# EAGLE schematic sp0256_dcf77 (EAGLE 7.7.0)
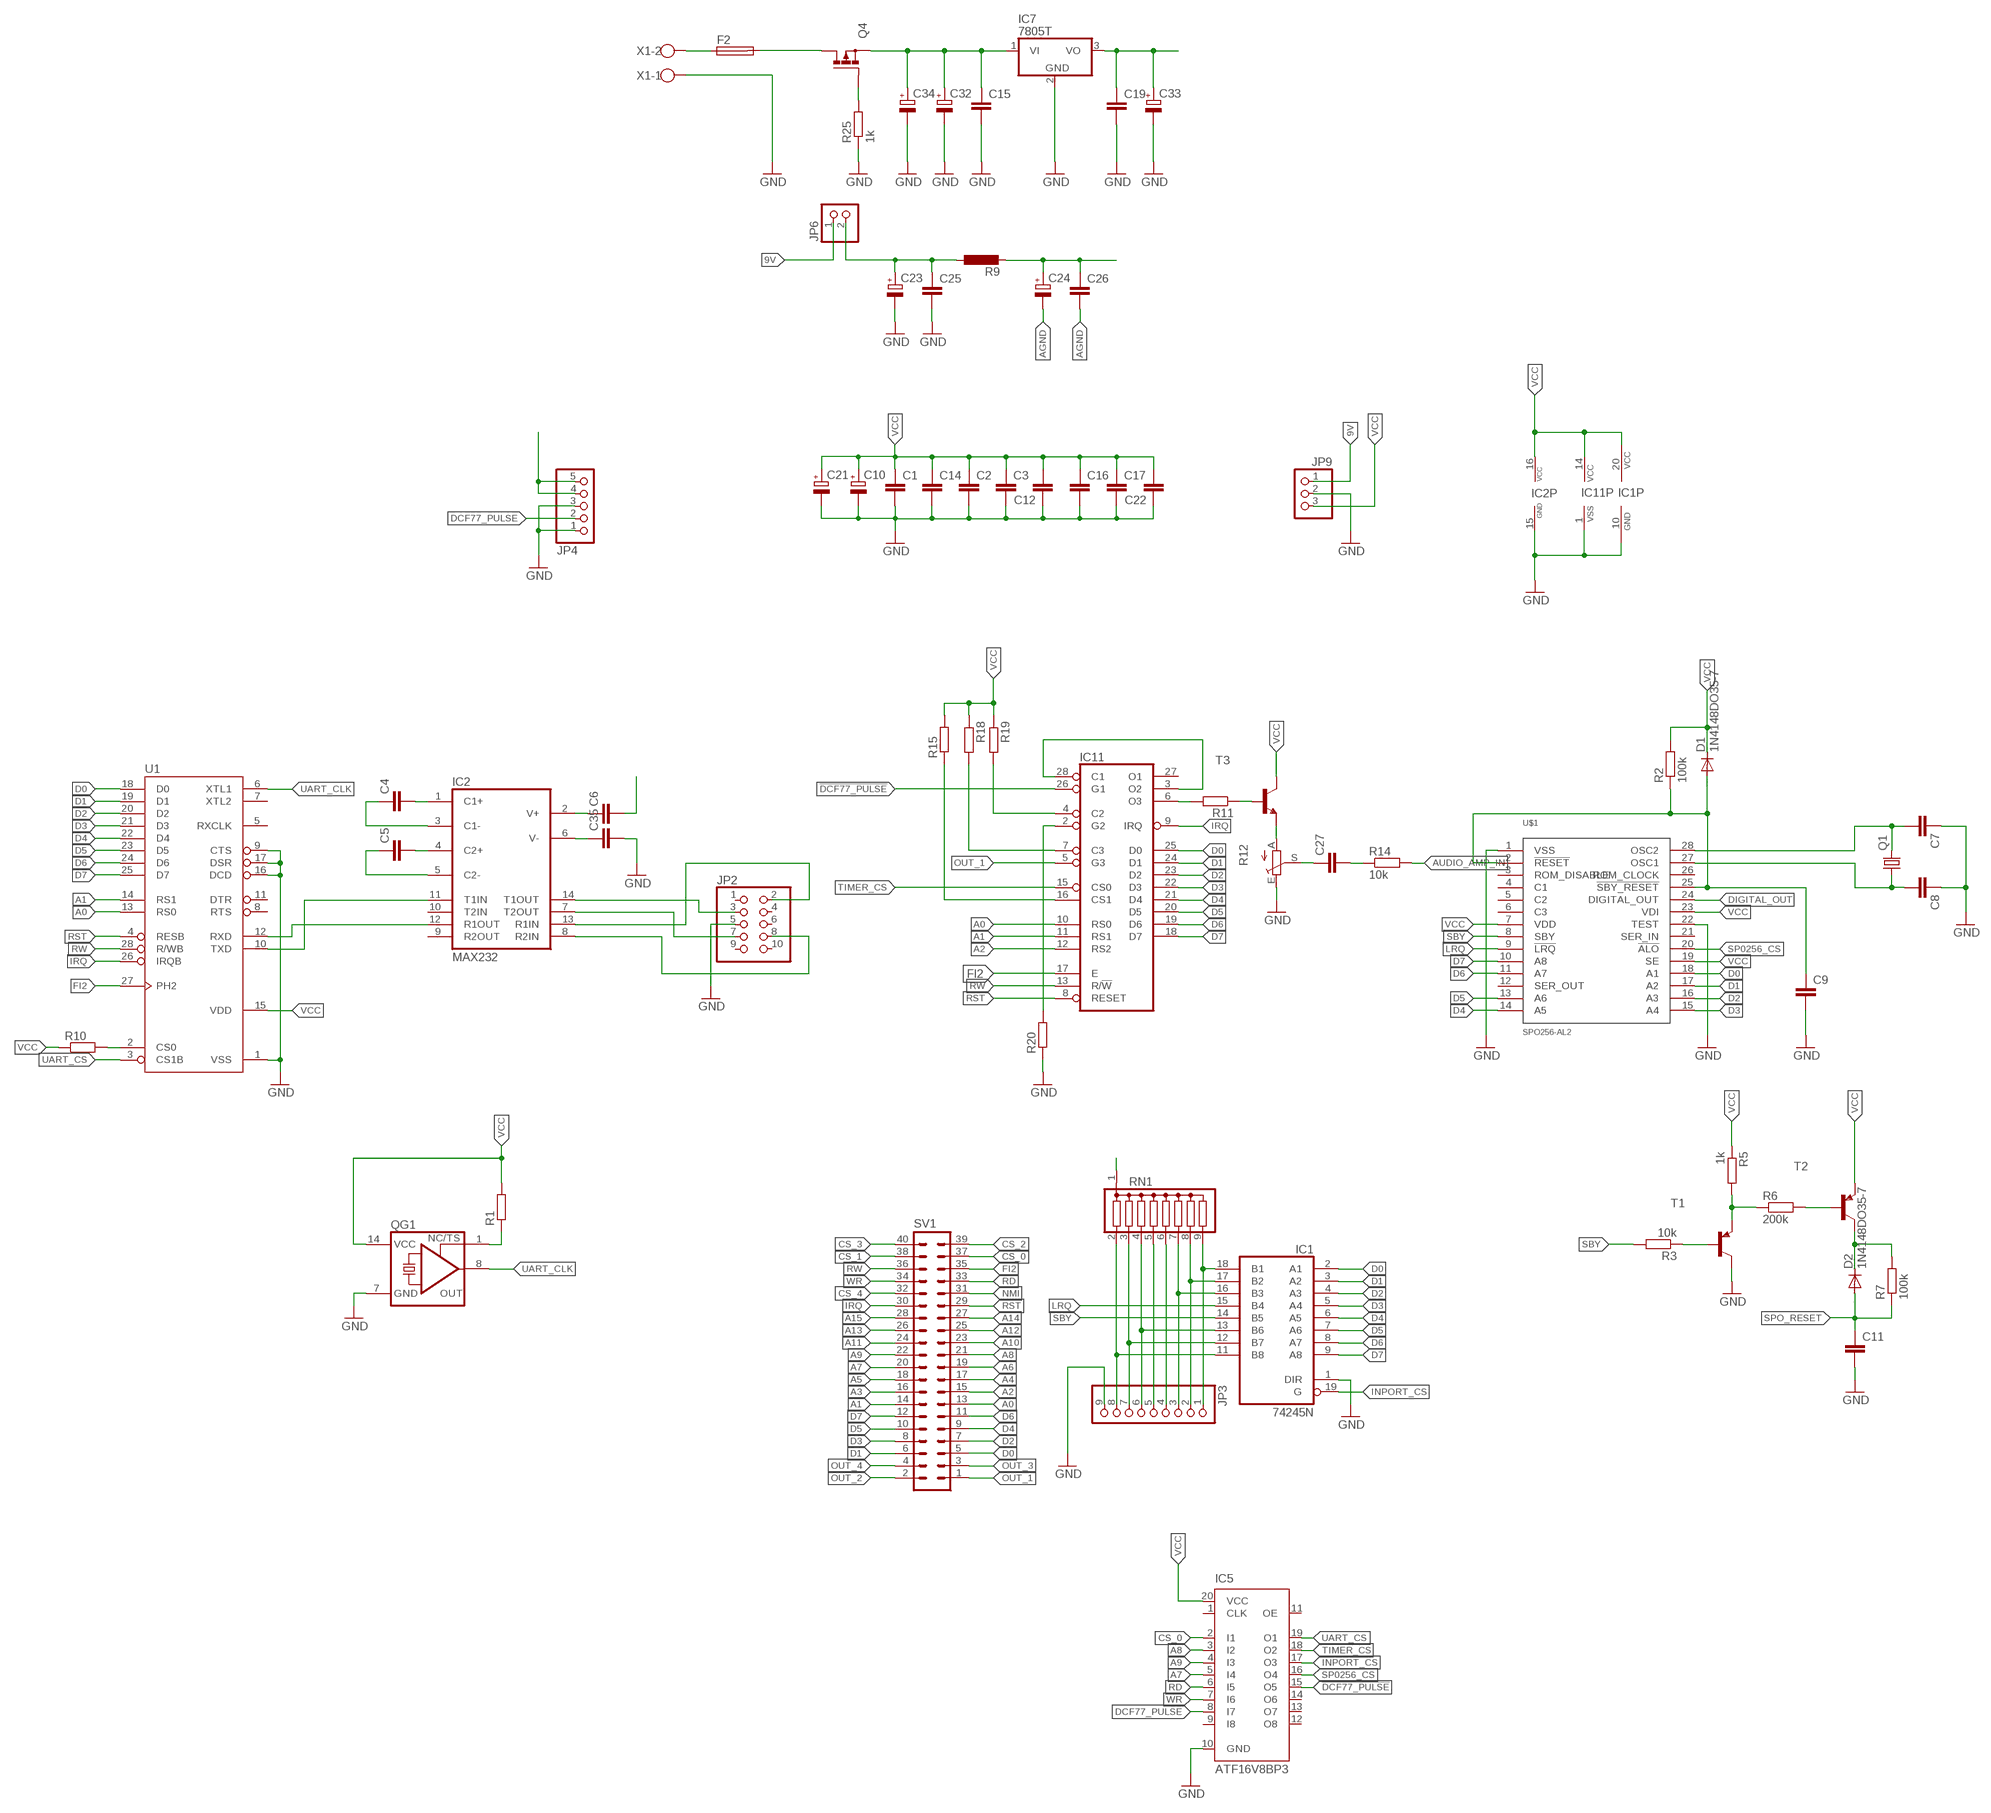
[diagram p0: schematic, sheet 1, part 1 of 2]
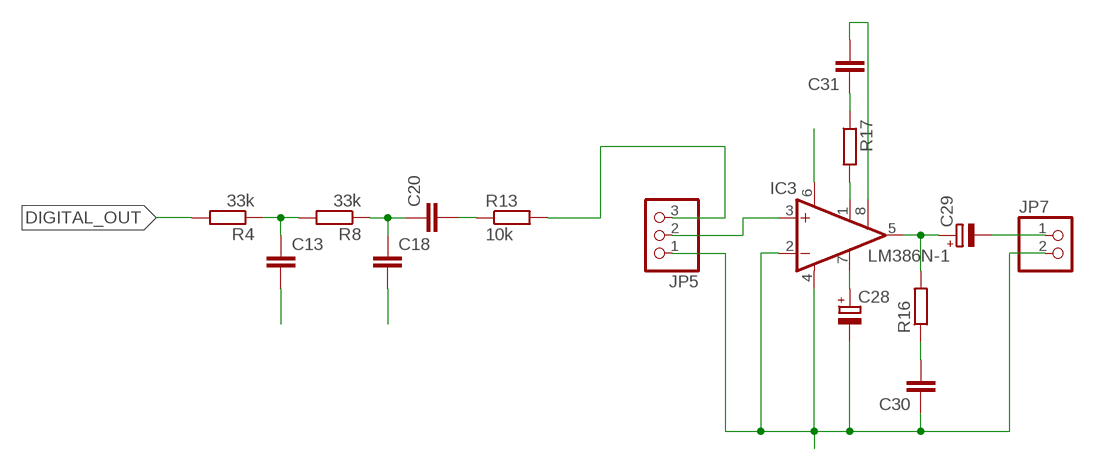
[diagram p1: schematic, sheet 1, part 2 of 2]

## Parts
C1  C-EUC1206  [C1206]
C2  C-EUC1206  [C1206]
C3  C-EUC1206  [C1206]
C4  C-EUC0603  [C0603]
C5  C-EUC0603  [C0603]
C6  C-EUC0603  [C0603]
C7  C-EUC0603  [C0603]
C8  C-EUC0603  [C0603]
C9  C-EUC0603  [C0603]
C10  CPOL-EUE5-10.5  [E5-10,5]
C11  C-EUC0603  [C0603]
C12  C-EUC0603  [C0603]
C13  C-EUC0603  [C0603]
C14  C-EUC1206  [C1206]
C15  C-EUC1206  [C1206]
C16  C-EUC1206  [C1206]
C17  C-EUC1206  [C1206]
C18  C-EUC0603  [C0603]
C19  C-EUC1206  [C1206]
C20  C-EUC0603  [C0603]
C21  CPOL-EUSMCB  [SMC_B]
C22  C-EUC0603  [C0603]
C23  CPOL-EUE5-10.5  [E5-10,5]
C24  CPOL-EUE5-10.5  [E5-10,5]
C25  C-EUC1206  [C1206]
C26  C-EUC1206  [C1206]
C27  C-EUC0603  [C0603]
C28  CPOL-EUSMCB  [SMC_B]
C29  CPOL-EUE5-10.5  [E5-10,5]
C30  C-EUC0603  [C0603]
C31  C-EUC0603  [C0603]
C32  CPOL-EUE5-10.5  [E5-10,5]
C33  CPOL-EUE5-10.5  [E5-10,5]
C34  CPOL-EUE5-10.5  [E5-10,5]
C35  C-EUC0603  [C0603]
D1  1N4148DO35-7  [DO35-7]
D2  1N4148DO35-7  [DO35-7]
F2  SH22,5  [SH22,5]
IC1  74245N  74LS245N  [DIL20]
IC2  MAX232  [DIL16]
IC3  LM386N-1  [DIL08]
IC5  ATF16V8BP3  [DIL20]
IC7  7805T  [TO220H]
IC11  6840  [DIL28]
JP2  PINHD-2X5  [2X05]
JP3  PINHD-1X9  [1X09]
JP4  PINHD-1X5  [1X05]
JP5  PINHD-1X3  [1X03]
JP6  PINHD-1X2  [1X02]
JP7  PINHD-1X2  [1X02]
JP9  PINHD-1X3/90  [1X03/90]
Q1  CRYSTALHC49U-V  [HC49U-V]
Q4  P-MOSFET-SO8  [SO-08]
QG1  XO-14  [DIL14S]
R1  R-EU_R1206  [R1206]
R2  100k  R-EU_0204/7  [0204/7]
R3  10k  R-EU_0204/7  [0204/7]
R4  33k  R-EU_0204/7  [0204/7]
R5  1k  R-EU_0204/5  [0204/5]
R6  200k  R-EU_R0603  [R0603]
R7  100k  R-EU_0204/7  [0204/7]
R8  33k  R-EU_0204/7  [0204/7]
R9  L-EU0204/7  [0204/7]
R10  R-EU_R0603  [R0603]
R11  R-EU_0204/7  [0204/7]
R12  TRIM_EU-CA6V  [CA6V]
R13  10k  R-EU_R0603  [R0603]
R14  10k  R-EU_R0603  [R0603]
R15  R-EU_R0603  [R0603]
R16  R-EU_R0603  [R0603]
R17  R-EU_0204/7  [0204/7]
R18  R-EU_R0603  [R0603]
R19  R-EU_R0603  [R0603]
R20  R-EU_R0603  [R0603]
R25  1k  R-EU_R0603  [R0603]
RN1  G08R  [SIL9]
SV1  ML40L  [ML40L]
T1  MPS2907A-PNP-TO92-CBE  [TO92-CBE]
T2  MPS2907A-PNP-TO92-CBE  [TO92-CBE]
T3  BC550-NPN-TO92-CBE  [TO92-CBE]
U1  G65SC51P  [DIP-28]
U$1  SPO256-AL2  [DIL28]
X1  W237-102  [W237-102]

## Nets
9V: C15.1 C32.+ C34.+ IC7.1(VI) JP6.1 JP9.1 Q4.1(S) Q4.2(S) Q4.3(S)
9V_SW: C23.+ C25.1 JP6.2 R9.1
!DCF77_PULSE: IC5.15(O5) IC11.26(G1)
A0: IC11.10(RS0) SV1.13 U1.13(RS0)
A1: IC11.11(RS1) SV1.14 U1.14(RS1)
A2: IC11.12(RS2) SV1.15
A3: SV1.16
A4: SV1.17
A5: SV1.18
A6: SV1.19
A7: IC5.5(I4) SV1.20
A8: IC5.3(I2) SV1.21
A9: IC5.4(I3) SV1.22
A10: SV1.23
A11: SV1.24
A12: SV1.25
A13: SV1.26
A14: SV1.27
A15: SV1.28
AGND: C13.2 C18.2 C24.- C26.2 C28.- C30.1 IC3.2(-IN) IC3.4(GND) JP5.1 JP7.2
AUDIO_AMP_IN: JP5.3 R13.2 R14.2
AVCC: C24.+ C26.1 IC3.6(VS) R9.2
CS_0: IC5.2(I1) SV1.37
CS_1: SV1.38
CS_2: SV1.39
CS_3: SV1.40
CS_4: SV1.32
D0: IC1.2(A1) IC11.25(D0) SV1.5 U1.18(D0) U$1.18(A1)
D1: IC1.3(A2) IC11.24(D1) SV1.6 U1.19(D1) U$1.17(A2)
D2: IC1.4(A3) IC11.23(D2) SV1.7 U1.20(D2) U$1.16(A3)
D3: IC1.5(A4) IC11.22(D3) SV1.8 U1.21(D3) U$1.15(A4)
D4: IC1.6(A5) IC11.21(D4) SV1.9 U1.22(D4) U$1.14(A5)
D5: IC1.7(A6) IC11.20(D5) SV1.10 U1.23(D5) U$1.13(A6)
D6: IC1.8(A7) IC11.19(D6) SV1.11 U1.24(D6) U$1.11(A7)
D7: IC1.9(A8) IC11.18(D7) SV1.12 U1.25(D7) U$1.10(A8)
DCF77_PULSE: IC5.8(I7) JP4.2
DIGITAL_OUT: R4.2 U$1.24(DIGITAL_OUT)
FI2: IC11.17(E) SV1.35 U1.27(PH2)
GATE2: IC11.2(G2) R20.2
GND: C1.2 C2.2 C3.2 C7.1 C8.1 C9.2 C10.- C11.2 C12.1 C14.2 C15.2 C16.2 C17.2 C19.2 C21.- C22.1 C23.- C25.2 C32.- C33.- C34.- C35.2 IC1.1(DIR) IC1.10(GND) IC2.15(GND) IC5.10(GND) IC7.2(GND) IC11.1(VSS) JP2.5 JP3.9 JP4.1 JP4.3 JP9.2 QG1.7(GND) R12.E R20.1 R25.1 T1.C U1.1(VSS) U1.9(CTS) U1.16(DCD) U1.17(DSR) U$1.1(VSS) U$1.22(TEST) X1.1
INPORT_CS: IC1.19(G) IC5.17(O3)
IRQ: IC11.9(IRQ) SV1.30 U1.26(IRQB)
LRQ: IC1.15(B4) U$1.9(!LRQ)
N$1: Q4.4(G) R25.2
N$3: IC11.3(O2) IC11.28(C1)
N$4: C35.1 IC2.6(V-)
N$5: QG1.1(TS) R1.1
N$6: C7.2 Q1.2 U$1.28(OSC2)
N$7: C8.2 Q1.1 U$1.27(OSC1)
N$8: R3.1 T1.B
N$9: C4.2 IC2.1(C1+)
N$10: C5.2 IC2.4(C2+)
N$11: C5.1 IC2.5(C2-)
N$12: C4.1 IC2.3(C1-)
N$13: C6.1 IC2.2(V+)
N$15: IC1.18(B1) JP3.1 RN1.9
N$16: IC1.17(B2) JP3.2 RN1.8
N$17: IC1.16(B3) JP3.3 RN1.7
N$18: C13.1 R4.1 R8.2
N$19: JP3.5 RN1.5
N$20: IC1.13(B6) JP3.6 RN1.4
N$21: IC1.12(B7) JP3.7 RN1.3
N$22: IC1.11(B8) JP3.8 RN1.2
N$26: JP3.4 RN1.6
N$27: R10.2 U1.2(CS0)
N$28: R5.2 R6.1 T1.E
N$29: R6.2 T2.B
N$30: D2.C R7.2 T2.C
N$31: IC11.16(CS1) R15.1
N$32: C18.1 C20.1 R8.1
N$33: C28.+ IC3.7(BYPASS)
N$34: IC11.7(C3) R18.2
N$35: IC11.6(O3) R11.2
N$36: R11.1 T3.B
N$38: R12.A T3.E
N$39: C27.1 R12.S
N$40: C27.2 R14.1
N$41: C20.2 R13.1
N$42: IC3.3(+IN) JP5.2
N$43: C29.+ IC3.5(OUT) R16.2
N$45: C30.2 R16.1
N$46: IC3.1(GAIN) R17.2
N$47: C31.1 R17.1
N$48: C31.2 IC3.8(GAIN)
N$49: C29.- JP7.1
N$50: IC11.4(C2) R19.2
N$52: F2.2 Q4.5(D) Q4.6(D) Q4.7(D) Q4.8(D)
N$53: F2.1 X1.2
NMI: SV1.31
OUT_1: IC11.5(G3) SV1.1
OUT_2: SV1.2
OUT_3: SV1.3
OUT_4: SV1.4
RD: IC5.6(I5) SV1.33
RS_CTS: IC2.8(R2IN) JP2.8
RS_RTS: IC2.7(T2OUT) JP2.7
RS_RXD: IC2.13(R1IN) JP2.2
RS_TXD: IC2.14(T1OUT) JP2.3
RST: IC11.8(RESET) SV1.29 U1.4(RESB)
RW: IC11.13(R/!W) SV1.36 U1.28(R/WB)
RXD_TTL: IC2.12(R1OUT) U1.12(RXD)
SBY: IC1.14(B5) R3.2 U$1.8(SBY)
SP0256_CS: IC5.16(O4) U$1.20(!ALO)
SPO_RESET: C9.1 C11.1 D1.A D2.A R2.1 R7.1 U$1.2(!RESET) U$1.25(!SBY_RESET)
TIMER_CS: IC5.18(O2) IC11.15(CS0)
TXD_TTL: IC2.11(T1IN) U1.10(TXD)
UART_CLK: QG1.8(OUT) U1.6(XTL1)
UART_CS: IC5.19(O1) U1.3(CS1B)
VCC: C1.1 C2.1 C3.1 C6.2 C10.+ C12.2 C14.1 C16.1 C17.1 C19.1 C21.+ C22.2 C33.+ D1.C IC1.20(VCC) IC2.16(VCC) IC5.20(VCC) IC7.3(VO) IC11.14(VCC) JP4.4 JP4.5 JP9.3 QG1.14(VCC) R1.2 R2.2 R5.1 R10.1 R15.2 R18.1 R19.1 RN1.1 T2.E T3.C U1.15(VDD) U$1.7(VDD) U$1.19(SE) U$1.23(VDI)
WR: IC5.7(I6) SV1.34
Unconnected: IC2.9(R2OUT) IC2.10(T2IN) IC5.1(CLK) IC5.9(I8) IC5.11(OE) IC5.12(O8) IC5.13(O7) IC5.14(O6) IC11.27(O1) JP2.1 JP2.4 JP2.6 JP2.9 JP2.10 U1.5(RXCLK) U1.7(XTL2) U1.8(RTS) U1.11(DTR) U$1.3(ROM_DISABLE) U$1.4(C1) U$1.5(C2) U$1.6(C3) U$1.12(SER_OUT) U$1.21(SER_IN) U$1.26(ROM_CLOCK)

## Library data of the parts
C1-C9 C11-C20 C22 C25-C27 C30 C31 C35 = rcl:C-EU: CAPACITOR, European symbol
C10 C21 C23 C24 C28 C29 C32-C34 = rcl:CPOL-EU: POLARIZED CAPACITOR, European symbol
D1 D2 = diode:1N4148: DIODE high speed (Philips)
F2 = fuse:SH22,5: FUSE HOLDER grid 22,5 mm, OGN0031 8201, Schurter (Buerklin); MF: SCHURTER; MPN: 0031.8201; OC_FARNELL: 1162740; OC_NEWARK: 96F8317
IC1 = 74xx-us:74*245: Octal BUS TRANSCEIVER, 3-state
IC2 = maxim:MAX232: RS232 TRANSCEIVER; MF: MAXIM; MPN: MAX232ACPE+; OC_FARNELL: 9723773; OC_NEWARK: 68K4544
IC3 = linear:LM386?-*: Low Voltage Audio Power Amplifier Source: http://cache.national.com/ds/LM/LM386.pdf
IC5 = atmel:ATF16V8B: High perfomance CMOS (electrically erasable) programmable logic device (PLD) ABLE-Atmel-ABEL - P18V8R, P16V8C, P16V8AS, P17V8 COPL Atmel-WinCUPL - G16V8MS, G16V8MA, G16V8AS, G16V8 LOG/IC - GAL16V8_R, GAL16V8_G7, GAL16V8_C), GAL16V8 Tango-PLD - G16V8R, G16V8C, G16V8AS, G16V8 Source: http://www.atmel.com/dyn/resources/prod_documents/DOC0364.PDF; MPN: ATF16V8CZ-15PU; OC_FARNELL: 1551768; OC_NEWARK: 94M6254
IC7 = linear:78*: Positive VOLTAGE REGULATOR Source: http://cache.national.com/ds/LM/LM78L05.pdf http://www.fairchildsemi.com/ds/LM/LM7805.pdf
IC11 = micro-motorola:6840: MICROCONTROLLER/MEMORY DEVICE; OC_FARNELL: unknown; OC_NEWARK: unknown
JP2 = pinhead:PINHD-2X5: PIN HEADER
JP3 = pinhead:PINHD-1X9: PIN HEADER
JP4 = pinhead:PINHD-1X5: PIN HEADER
JP5 JP9 = pinhead:PINHD-1X3: PIN HEADER
JP6 JP7 = pinhead:PINHD-1X2: PIN HEADER
Q1 = crystal:CRYSTAL: CRYSTAL; OC_FARNELL: 1666969; OC_NEWARK: unknown
Q4 = transistor-power:P-MOSFET-SO8: P-Channel MOSFET Example: FDS4435A; P-Channel Logic Level PowerTrench® MOSFET FDS4465; P-Channel 1.8V Specified PowerTrench® MOSFET Source: www.fairchildsemi.com
QG1 = crystal:XO-: CRYSTAL; OC_FARNELL: unknown; OC_NEWARK: unknown
R1-R8 R10 R11 R13-R20 R25 = rcl:R-EU_: RESISTOR, European symbol
R9 = rcl:L-EU: INDUCTOR, European symbol
R12 = pot:TRIM_EU-: POTENTIOMETER
RN1 = resistor-sil:G08R: SIL RESISTOR; OC_FARNELL: unknown; OC_NEWARK: unknown
SV1 = con-harting-ml:ML40: HARTING; OC_FARNELL: unknown; OC_NEWARK: unknown
T1 T2 = transistor:*-PNP-: PNP Transistror
T3 = transistor:*-NPN-: NPN Transistror BF959 corrected 2008.03.06
U1 = 65xxx:G65SC51P: California Micro Devices Version
U$1 = mw:SPO256-AL2
X1 = con-wago-500:W237-102: WAGO SCREW CLAMP; MPN: 237-102; OC_FARNELL: unknown; OC_NEWARK: 70K9898